# Altium schematic sheet QSFP_Jumper.SchDoc
size A4
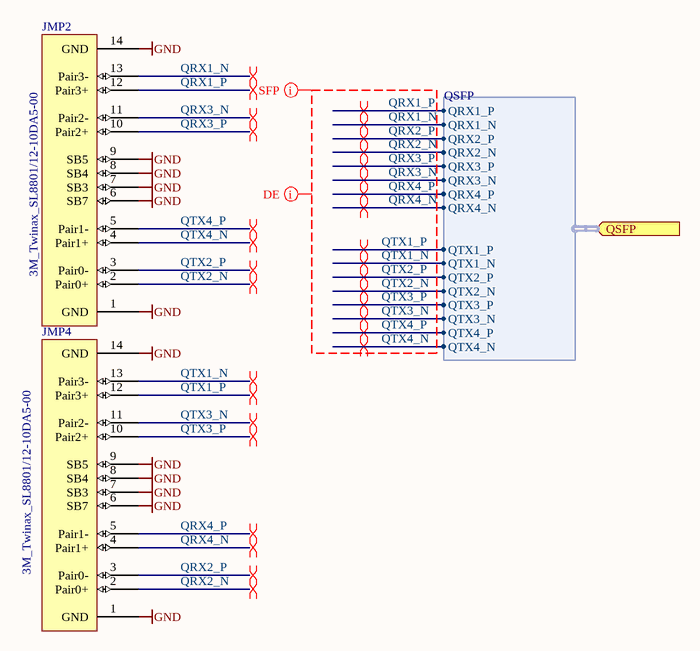
[diagram p0: QSFP_Jumper.SchDoc]

## Parts
JMP2  3M_Twinax_SL8801/12-10DA5-00  [3M_Twinax_SL8801/12-10DA5-00]
JMP4  3M_Twinax_SL8801/12-10DA5-00  [3M_Twinax_SL8801/12-10DA5-00]

## Ports
QSFP (in, harness QSFP)

## Harnesses
QSFP: QRX1_P, QRX1_N, QRX2_P, QRX2_N, QRX3_P, QRX3_N, QRX4_P, QRX4_N, QTX1_P, QTX1_N, QTX2_P, QTX2_N, QTX3_P, QTX3_N, QTX4_P, QTX4_N

## Nets
GND: JMP2.1(GND) JMP2.6(SB7) JMP2.7(SB3) JMP2.8(SB4) JMP2.9(SB5) JMP2.14(GND) JMP4.1(GND) JMP4.6(SB7) JMP4.7(SB3) JMP4.8(SB4) JMP4.9(SB5) JMP4.14(GND)
QRX1_N: JMP2.13(Pair3-) ; port QSFP.QRX1_N
QRX1_P: JMP2.12(Pair3+) ; port QSFP.QRX1_P
QRX2_N: JMP4.2(Pair0+) ; port QSFP.QRX2_N
QRX2_P: JMP4.3(Pair0-) ; port QSFP.QRX2_P
QRX3_N: JMP2.11(Pair2-) ; port QSFP.QRX3_N
QRX3_P: JMP2.10(Pair2+) ; port QSFP.QRX3_P
QRX4_N: JMP4.4(Pair1+) ; port QSFP.QRX4_N
QRX4_P: JMP4.5(Pair1-) ; port QSFP.QRX4_P
QTX1_N: JMP4.13(Pair3-) ; port QSFP.QTX1_N
QTX1_P: JMP4.12(Pair3+) ; port QSFP.QTX1_P
QTX2_N: JMP2.2(Pair0+) ; port QSFP.QTX2_N
QTX2_P: JMP2.3(Pair0-) ; port QSFP.QTX2_P
QTX3_N: JMP4.11(Pair2-) ; port QSFP.QTX3_N
QTX3_P: JMP4.10(Pair2+) ; port QSFP.QTX3_P
QTX4_N: JMP2.4(Pair1+) ; port QSFP.QTX4_N
QTX4_P: JMP2.5(Pair1-) ; port QSFP.QTX4_P

## Layout directives
differential pair: QRX1_N, QRX1_P, QRX2_N, QRX2_P, QRX3_N, QRX3_P, QRX4_N, QRX4_P, QTX1_N, QTX1_P, QTX2_N, QTX2_P, QTX3_N, QTX3_P, QTX4_N, QTX4_P
net class SFP: QRX1_N, QRX1_P, QRX2_N, QRX2_P, QRX3_N, QRX3_P, QRX4_N, QRX4_P, QTX1_N, QTX1_P, QTX2_N, QTX2_P, QTX3_N, QTX3_P, QTX4_N, QTX4_P
net class DE: QRX1_N, QRX1_P, QRX2_N, QRX2_P, QRX3_N, QRX3_P, QRX4_N, QRX4_P, QTX1_N, QTX1_P, QTX2_N, QTX2_P, QTX3_N, QTX3_P, QTX4_N, QTX4_P

## Library data of the parts
JMP2 JMP4 = CBL_TWINAX_3M_4pairs_SB: Flat Ribbon Cable Silver 8 (4 Pair) Conductors 0.093" (2.37mm) Between Pairs Flat Twin Axial 500.0' (152.40m)